# Altium schematic sheet ESRA_tsk3000 - Copy.SchDoc
size A2; PageSetup: Record=PageOptions|CenterHorizontal=True|CenterVertical=True|PrintScale=0.50|XCorrection=1.00|YCorrection=1.00|PrintKind=1|BorderSize=5000000|LeftOffset=0|BottomOffset=0|Orientation=2|PaperLength=1000|PaperWidth=1000|Scale=100|PaperSource=15|PrintQuality=600|MediaType=1|DitherType=10|PaperKind=A3 (297 x 420 mm)|PrintScaleMode=1
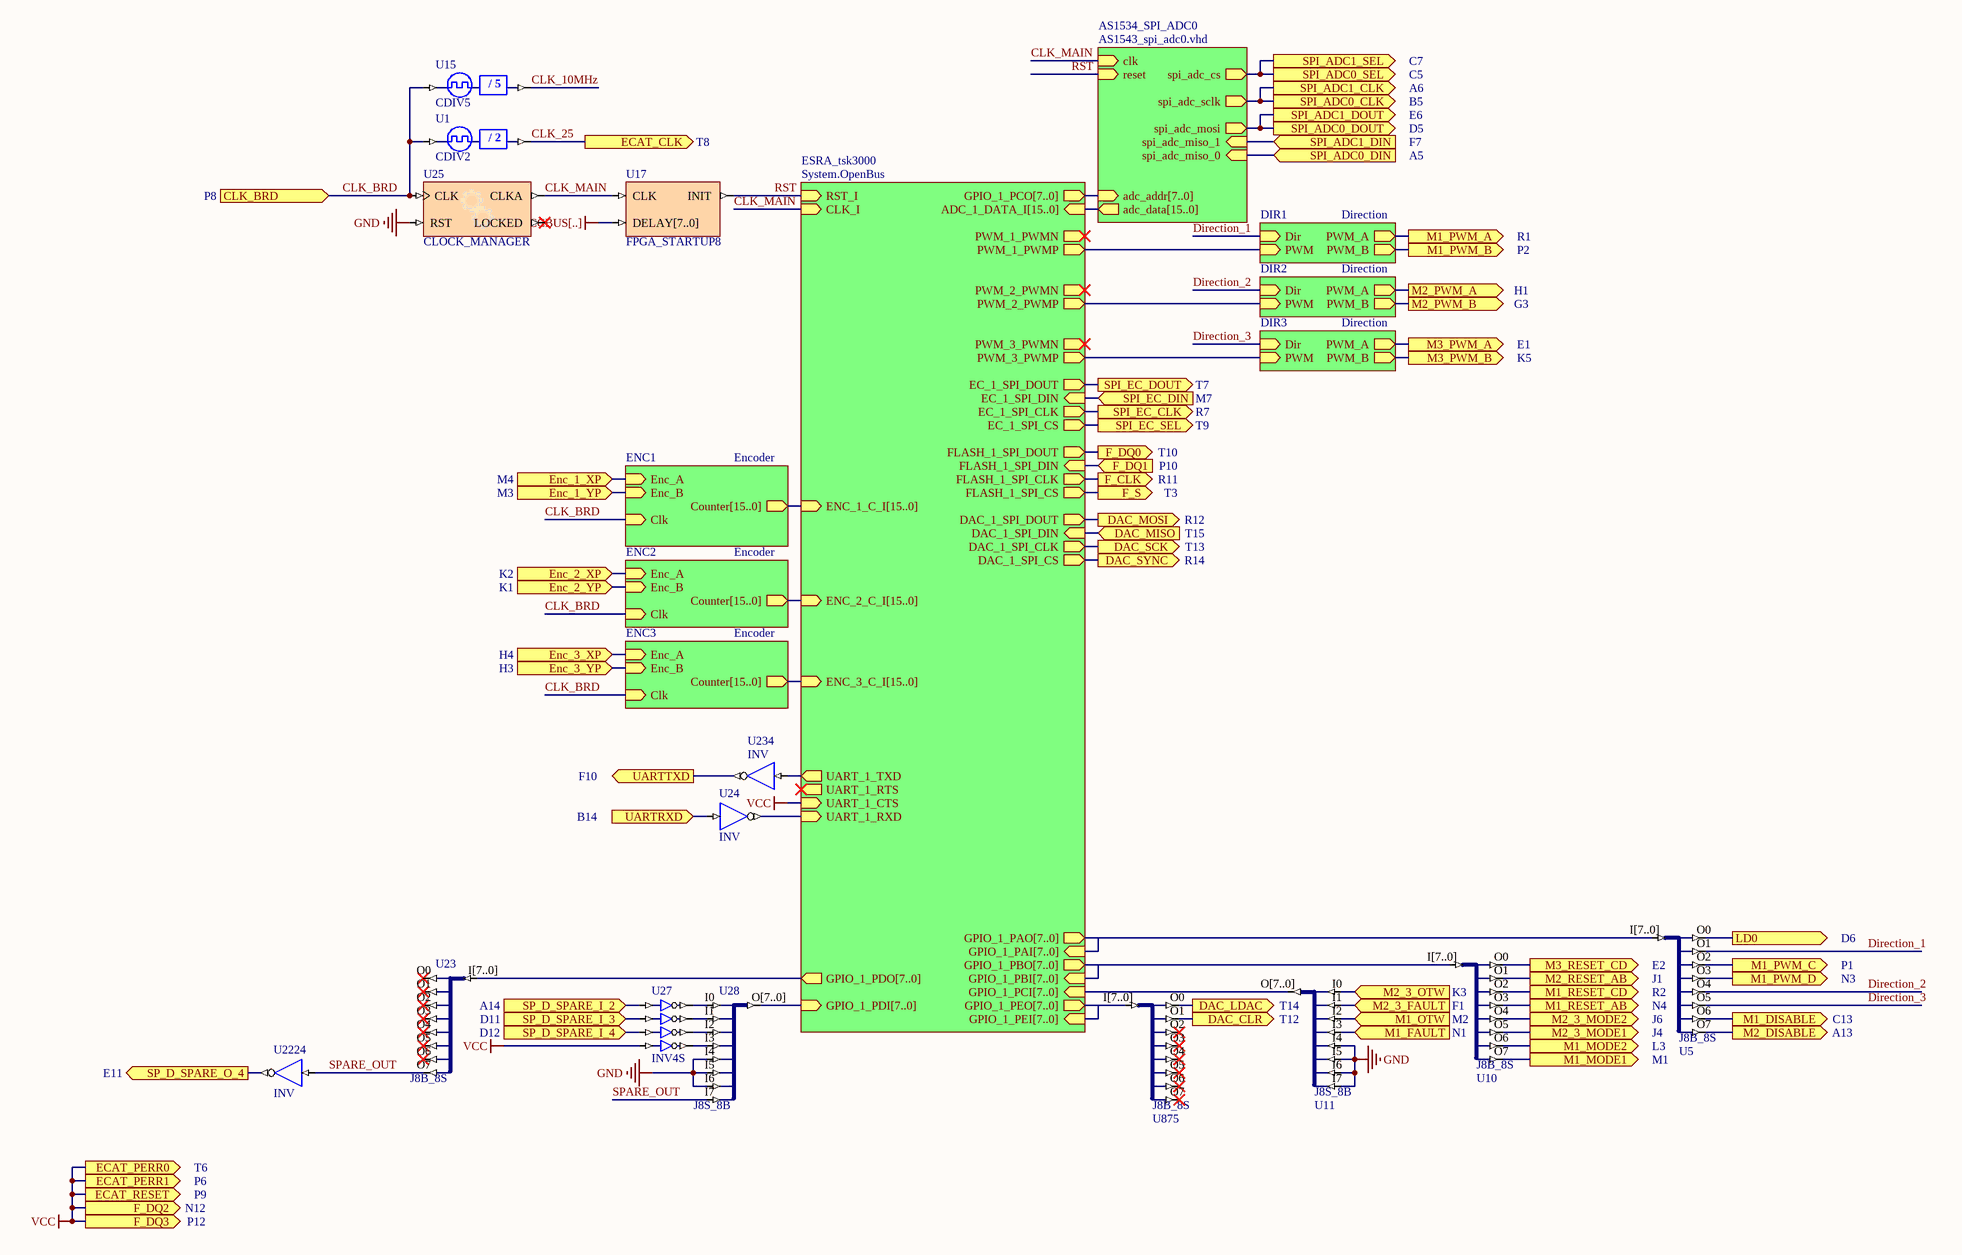
[diagram p0: ESRA_tsk3000 - Copy.SchDoc]

## Parts
U1  CDIV2
U5  J8B_8S
U10  J8B_8S
U11  J8S_8B
U15  CDIV5
U17  FPGA_STARTUP8
U23  J8B_8S
U24  INV
U25  CLOCK_MANAGER
U27  INV4S
U28  J8S_8B
U234  INV
U875  J8B_8S
U2224  INV

## Sub-sheets
AS1534_SPI_ADC0 = AS1543_spi_adc0.vhd: clk (in), spi_adc_sclk (out), spi_adc_mosi (out), spi_adc_cs (out), adc_addr[7..0] (in), adc_data[15..0] (out), reset (in), spi_adc_miso_0 (in), spi_adc_miso_1 (in)
DIR1 = Direction: Dir (in), PWM (in), PWM_A (out), PWM_B (out)
DIR2 = Direction: Dir (in), PWM (in), PWM_A (out), PWM_B (out)
DIR3 = Direction: Dir (in), PWM (in), PWM_A (out), PWM_B (out)
ENC1 = Encoder: Enc_A (in), Enc_B (in), Clk (in), Counter[15..0] (out)
ENC2 = Encoder: Enc_A (in), Enc_B (in), Clk (in), Counter[15..0] (out)
ENC3 = Encoder: Enc_A (in), Enc_B (in), Clk (in), Counter[15..0] (out)
ESRA_tsk3000 = System.OpenBus: RST_I (in), CLK_I (in), EC_1_SPI_DOUT (out), EC_1_SPI_DIN (in), EC_1_SPI_CLK (out), EC_1_SPI_CS (out), ENC_1_C_I[15..0] (in), ENC_2_C_I[15..0] (in), ENC_3_C_I[15..0] (in), PWM_1_PWMN (out), PWM_1_PWMP (out), PWM_2_PWMN (out), PWM_2_PWMP (out), PWM_3_PWMN (out), PWM_3_PWMP (out), GPIO_1_PAO[7..0] (out), GPIO_1_PBO[7..0] (out), GPIO_1_PAI[7..0] (in), GPIO_1_PBI[7..0] (in), ADC_1_DATA_I[15..0] (in), UART_1_TXD (out), UART_1_RXD (in), UART_1_CTS (in), UART_1_RTS (out), GPIO_1_PCO[7..0] (out), GPIO_1_PCI[7..0] (in), DAC_1_SPI_DOUT (out), DAC_1_SPI_DIN (in), DAC_1_SPI_CLK (out), DAC_1_SPI_CS (out), GPIO_1_PDO[7..0] (out), GPIO_1_PDI[7..0] (in), GPIO_1_PEO[7..0] (out), GPIO_1_PEI[7..0] (in), FLASH_1_SPI_DOUT (out), FLASH_1_SPI_DIN (in), FLASH_1_SPI_CLK (out), FLASH_1_SPI_CS (out)

## Ports
CLK_BRD (in, see P8), DAC_CLR (out, see T12), DAC_LDAC (out, see T14), DAC_MISO (in, see T15), DAC_MOSI (out, see R12), DAC_SCK (out, see T13), DAC_SYNC (out, see R14), ECAT_CLK (out, see T8), ECAT_PERR0 (out, see T6), ECAT_PERR1 (out, see P6), ECAT_RESET (out, see P9), Enc_1_XP (in, see M4), Enc_1_YP (in, see M3), Enc_2_XP (in, see K2), Enc_2_YP (in, see K1), Enc_3_XP (in, see H4), Enc_3_YP (in, see H3), F_CLK (out, see R11), F_DQ0 (out, see T10), F_DQ1 (in, see P10), F_DQ2 (out, see N12), F_DQ3 (out, see P12), F_S (out, see T3), LD0 (out, see D6), M1_DISABLE (out, see C13), M1_FAULT (in, see N1), M1_MODE1 (out, see M1), M1_MODE2 (out, see L3), M1_OTW (in, see M2), M1_PWM_A (out, see R1), M1_PWM_B (out, see P2), M1_PWM_C (out, see P1), M1_PWM_D (out, see N3), M1_RESET_AB (out, see N4), M1_RESET_CD (out, see R2), M2_3_FAULT (in, see F1), M2_3_MODE1 (out, see J4), M2_3_MODE2 (out, see J6), M2_3_OTW (in, see K3), M2_DISABLE (out, see A13), M2_PWM_A (out, see H1), M2_PWM_B (out, see G3), M2_RESET_AB (out, see J1), M3_PWM_A (out, see E1), M3_PWM_B (out, see K5), M3_RESET_CD (out, see E2), SP_D_SPARE_I_2 (in, see A14), SP_D_SPARE_I_3 (in, see D11), SP_D_SPARE_I_4 (in, see D12), SP_D_SPARE_O_4 (out, see E11), SPI_ADC0_CLK (out, see B5), SPI_ADC0_DIN (in, see A5), SPI_ADC0_DOUT (out, see D5), SPI_ADC0_SEL (out, see C5), SPI_ADC1_CLK (out, see A6), SPI_ADC1_DIN (in, see F7), SPI_ADC1_DOUT (out, see E6), SPI_ADC1_SEL (out, see C7), SPI_EC_CLK (out, see R7), SPI_EC_DIN (in, see M7), SPI_EC_DOUT (out, see T7), SPI_EC_SEL (out, see T9), UARTRXD (in, see B14), UARTTXD (out, see F10)

## Nets
GND: U11.I4 U11.I5 U11.I6 U11.I7 U25.RST U28.I4 U28.I5 U28.I6
VCC: U27.I3 ; port ECAT_PERR0, port ECAT_PERR1, port ECAT_RESET, port F_DQ2, port F_DQ3, sheet ESRA_tsk3000/UART_1_CTS
VCCBUS[..]: U17.DELAY[7..0]
CLK_10MHz: U15.CLKDV
CLK_25: U1.CLKDV ; port ECAT_CLK
CLK_BRD: U1.CLKIN U15.CLKIN U25.CLK ; port CLK_BRD, sheet ENC1/Clk, sheet ENC2/Clk, sheet ENC3/Clk
CLK_MAIN: U17.CLK U25.CLKA ; sheet ESRA_tsk3000/CLK_I, sheet AS1534_SPI_ADC0/clk
DAC_CLR: U875.O1 ; port DAC_CLR
DAC_LDAC: U875.O0 ; port DAC_LDAC
DAC_MISO: port DAC_MISO, sheet ESRA_tsk3000/DAC_1_SPI_DIN
DAC_MOSI: port DAC_MOSI, sheet ESRA_tsk3000/DAC_1_SPI_DOUT
DAC_SCK: port DAC_SCK, sheet ESRA_tsk3000/DAC_1_SPI_CLK
DAC_SYNC: port DAC_SYNC, sheet ESRA_tsk3000/DAC_1_SPI_CS
Direction_1: U5.O1 ; sheet DIR1/Dir
Direction_2: U5.O4 ; sheet DIR2/Dir
Direction_3: U5.O5 ; sheet DIR3/Dir
Enc_1_XP: port Enc_1_XP, sheet ENC1/Enc_A
Enc_1_YP: port Enc_1_YP, sheet ENC1/Enc_B
Enc_2_XP: port Enc_2_XP, sheet ENC2/Enc_A
Enc_2_YP: port Enc_2_YP, sheet ENC2/Enc_B
Enc_3_XP: port Enc_3_XP, sheet ENC3/Enc_A
Enc_3_YP: port Enc_3_YP, sheet ENC3/Enc_B
F_CLK: port F_CLK, sheet ESRA_tsk3000/FLASH_1_SPI_CLK
F_DQ0: port F_DQ0, sheet ESRA_tsk3000/FLASH_1_SPI_DOUT
F_DQ1: port F_DQ1, sheet ESRA_tsk3000/FLASH_1_SPI_DIN
F_S: port F_S, sheet ESRA_tsk3000/FLASH_1_SPI_CS
LD0: U5.O0 ; port LD0
M1_DISABLE: U5.O6 ; port M1_DISABLE
M1_FAULT: U11.I3 ; port M1_FAULT
M1_MODE1: U10.O7 ; port M1_MODE1
M1_MODE2: U10.O6 ; port M1_MODE2
M1_OTW: U11.I2 ; port M1_OTW
M1_PWM_A: port M1_PWM_A, sheet DIR1/PWM_A
M1_PWM_B: port M1_PWM_B, sheet DIR1/PWM_B
M1_PWM_C: U5.O2 ; port M1_PWM_C
M1_PWM_D: U5.O3 ; port M1_PWM_D
M1_RESET_AB: U10.O3 ; port M1_RESET_AB
M1_RESET_CD: U10.O2 ; port M1_RESET_CD
M2_3_FAULT: U11.I1 ; port M2_3_FAULT
M2_3_MODE1: U10.O5 ; port M2_3_MODE1
M2_3_MODE2: U10.O4 ; port M2_3_MODE2
M2_3_OTW: U11.I0 ; port M2_3_OTW
M2_DISABLE: U5.O7 ; port M2_DISABLE
M2_PWM_A: port M2_PWM_A, sheet DIR2/PWM_A
M2_PWM_B: port M2_PWM_B, sheet DIR2/PWM_B
M2_RESET_AB: U10.O1 ; port M2_RESET_AB
M3_PWM_A: port M3_PWM_A, sheet DIR3/PWM_A
M3_PWM_B: port M3_PWM_B, sheet DIR3/PWM_B
M3_RESET_CD: U10.O0 ; port M3_RESET_CD
RST: U17.INIT ; sheet ESRA_tsk3000/RST_I, sheet AS1534_SPI_ADC0/reset
SP_D_SPARE_I_2: U27.I0 ; port SP_D_SPARE_I_2
SP_D_SPARE_I_3: U27.I1 ; port SP_D_SPARE_I_3
SP_D_SPARE_I_4: U27.I2 ; port SP_D_SPARE_I_4
SP_D_SPARE_O_4: U2224.O ; port SP_D_SPARE_O_4
SPARE_OUT: U23.O7 U28.I7 U2224.I
SPI_ADC0_CLK: port SPI_ADC0_CLK, port SPI_ADC1_CLK, sheet AS1534_SPI_ADC0/spi_adc_sclk
SPI_ADC0_DIN: port SPI_ADC0_DIN, sheet AS1534_SPI_ADC0/spi_adc_miso_0
SPI_ADC0_DOUT: port SPI_ADC0_DOUT, port SPI_ADC1_DOUT, sheet AS1534_SPI_ADC0/spi_adc_mosi
SPI_ADC0_SEL: port SPI_ADC0_SEL, port SPI_ADC1_SEL, sheet AS1534_SPI_ADC0/spi_adc_cs
SPI_ADC1_DIN: port SPI_ADC1_DIN, sheet AS1534_SPI_ADC0/spi_adc_miso_1
SPI_EC_CLK: port SPI_EC_CLK, sheet ESRA_tsk3000/EC_1_SPI_CLK
SPI_EC_DIN: port SPI_EC_DIN, sheet ESRA_tsk3000/EC_1_SPI_DIN
SPI_EC_DOUT: port SPI_EC_DOUT, sheet ESRA_tsk3000/EC_1_SPI_DOUT
SPI_EC_SEL: port SPI_EC_SEL, sheet ESRA_tsk3000/EC_1_SPI_CS
UARTRXD: U24.I ; port UARTRXD
UARTTXD: U234.O ; port UARTTXD
NetU5_I[7..0]: U5.I[7..0] ; sheet ESRA_tsk3000/GPIO_1_PAO[7..0], sheet ESRA_tsk3000/GPIO_1_PAI[7..0]
NetU10_I[7..0]: U10.I[7..0] ; sheet ESRA_tsk3000/GPIO_1_PBO[7..0], sheet ESRA_tsk3000/GPIO_1_PBI[7..0]
NetU11_O[7..0]: U11.O[7..0] ; sheet ESRA_tsk3000/GPIO_1_PCI[7..0]
NetU23_I[7..0]: U23.I[7..0] ; sheet ESRA_tsk3000/GPIO_1_PDO[7..0]
NetU24_O: U24.O ; sheet ESRA_tsk3000/UART_1_RXD
NetU27_O0: U27.O0 U28.I0
NetU27_O1: U27.O1 U28.I1
NetU27_O2: U27.O2 U28.I2
NetU27_O3: U27.O3 U28.I3
NetU28_O[7..0]: U28.O[7..0] ; sheet ESRA_tsk3000/GPIO_1_PDI[7..0]
NetU234_I: U234.I ; sheet ESRA_tsk3000/UART_1_TXD
NetU875_I[7..0]: U875.I[7..0] ; sheet ESRA_tsk3000/GPIO_1_PEO[7..0], sheet ESRA_tsk3000/GPIO_1_PEI[7..0]
(unnamed): sheet ESRA_tsk3000/PWM_1_PWMP, sheet DIR1/PWM
(unnamed): sheet ESRA_tsk3000/PWM_2_PWMP, sheet DIR2/PWM
(unnamed): sheet ESRA_tsk3000/PWM_3_PWMP, sheet DIR3/PWM

Not connected (* = marked no-connect by the designer): U23 O0* O1* O2* O3* O4* O5* O6*; U25 LOCKED*; U875 O2* O3* O4* O5* O6* O7*

## Buses and harness runs
bus sheet AS1534_SPI_ADC0/adc_addr[7..0] = sheet ESRA_tsk3000/GPIO_1_PCO[7..0]
bus sheet AS1534_SPI_ADC0/adc_data[15..0] = sheet ESRA_tsk3000/ADC_1_DATA_I[15..0]
bus sheet ENC1/Counter[15..0] = sheet ESRA_tsk3000/ENC_1_C_I[15..0]
bus sheet ENC2/Counter[15..0] = sheet ESRA_tsk3000/ENC_2_C_I[15..0]
bus sheet ENC3/Counter[15..0] = sheet ESRA_tsk3000/ENC_3_C_I[15..0]
bus sheet ESRA_tsk3000/GPIO_1_PAI[7..0] = sheet ESRA_tsk3000/GPIO_1_PAO[7..0]
bus sheet ESRA_tsk3000/GPIO_1_PBI[7..0] = sheet ESRA_tsk3000/GPIO_1_PBO[7..0]
bus sheet ESRA_tsk3000/GPIO_1_PEI[7..0] = sheet ESRA_tsk3000/GPIO_1_PEO[7..0]

## Notes on the sheet
- (in symbol CDIV2) / 2
- (in symbol CDIV5) / 5

## Library data of the parts
U1 = CDIV2: Clock Divider by 2; DivisorRate: 2; ArchiveName: GENERIC; VHDLIB_SIM: GENERIC_LIB; Published: 29-Jan-2004; Publisher: Altium Limited; LastRevisionNo: 1.00.00; HelpURL: CR0118 FPGA Generic Library Guide.pdf#page=142; ComponentLink1URL: CR0127 FPGA Clock Divider Resource Usage.pdf#page=2; ComponentLink1Description: Core &Resource Usage; FunctionalClass: Clock Divider
U5 U10 U23 U875 = J8B_8S: 8-Bit input bus to 8 single pin outputs; FunctionalClass: Bus Joiner; PortSize: 8; ArchiveName: GENERIC; VHDLIB_SIM: GENERIC_LIB; Published: 29-Jan-2004; Publisher: Altium Limited; LastRevisionNo: 1.00.00; HelpURL: CR0118 FPGA Generic Library Guide.pdf#page=304; ComponentLink1URL: CR0126 FPGA Bus Joiner Resource Usage.pdf#page=27; ComponentLink1Description: Core &Resource Usage
U11 U28 = J8S_8B: 8 Single pin inputs to single 8-Bit output bus; FunctionalClass: Bus Joiner; PortSize: 8; ArchiveName: GENERIC; VHDLIB_SIM: GENERIC_LIB; Published: 29-Jan-2004; Publisher: Altium Limited; LastRevisionNo: 1.00.00; HelpURL: CR0118 FPGA Generic Library Guide.pdf#page=306; ComponentLink1URL: CR0126 FPGA Bus Joiner Resource Usage.pdf#page=28; ComponentLink1Description: Core &Resource Usage
U15 = CDIV5: Clock Divider by 5; DivisorRate: 5; ArchiveName: GENERIC; VHDLIB_SIM: GENERIC_LIB; Published: 29-Jan-2004; Publisher: Altium Limited; LastRevisionNo: 1.00.00; HelpURL: CR0118 FPGA Generic Library Guide.pdf#page=142; ComponentLink1URL: CR0127 FPGA Clock Divider Resource Usage.pdf#page=7; ComponentLink1Description: Core &Resource Usage; FunctionalClass: Clock Divider
U17 = FPGA_STARTUP8: FPGA Startup With 8 Bit Delay; Published: 9-Dec-2004; Publisher: Altium Limited; HelpURL: CR0119 FPGA_STARTUPx Powerup Delay Unit.pdf; LastRevisionNo: 1.00.00; ComponentLink1Description: Core &Resource Usage; ComponentLink1URL: CR0139 FPGA Peripheral Resource Usage.pdf#page=11
U24 U234 U2224 = INV: Inverter; FunctionalClass: Logic Primitive; ArchiveName: GENERIC; VHDLIB_SIM: GENERIC_LIB; Published: 29-Jan-2004; Publisher: Altium Limited; XilinxEquivalent: INV; LastRevisionNo: 1.00.00; HelpURL: CR0118 FPGA Generic Library Guide.pdf#page=291; ComponentLink1URL: CR0136 FPGA Logic Primitive Resource Usage.pdf#page=61; ComponentLink1Description: Core &Resource Usage; SubClass: INV
U25 = CLOCKMANAGER: Configurable Clock Manager; ConfiguratorName: GENERIC_CLOCKMANAGER; ConfigurationParameters: {}Version[1.0]{}Option_Configuration[object _1: TClockManagerPersist / VersionMajor [ 0 / VersionMinor [ 0 / InputFreq [ 50.000000000000000000 / InputName [ 'CLK' / OutputTargets [ < / item / Name [ 'CLKA' / OutFreqMin [ 90.000000000000000000 / OutFreqMax [ 90.000000000000000000 / OutPostDivider [ 1.000000000000000000 / end> / OutputDevices [ < / item / Name [ 'Spartan6' / Valid [ True / OutputActuals [ < / item / Name [ 'CLK0' / Multipler [ 1.000000000000000000 / Divider [ 1.000000000000000000 / OutFreq [ 50.000000000000000000 / OutputMap [ 1 / end / item / Name [ 'CLK90' / Multipler [ 1.000000000000000000 / Divider [ 1.000000000000000000 / OutPhase [ 90.000000000000000000 / OutFreq [ 50.000000000000000000 / OutputMap [ 2 / end / item / Name [ 'CLK180' / Multipler [ 1.000000000000000000 / Divider [ 1.000000000000000000 / OutPhase [ 180.000000000000000000 / OutFreq [ 50.000000000000000000 / OutputMap [ 3 / end / item / Name [ 'CLK270' / Multipler [ 1.000000000000000000 / Divider [ 1.000000000000000000 / OutPhase [ 270.000000000000000000 / OutFreq [ 50.000000000000000000 / OutputMap [ 4 / end / item / Name [ 'CLK2X' / Multipler [ 2.000000000000000000 / Divider [ 1.000000000000000000 / OutFreq [ 100.000000000000000000 / OutputMap [ 5 / end / item / Name [ 'CLKDV' / Multipler [ 1.000000000000000000 / Divider [ 16.000000000000000000 / OutFreq [ 3.125000000000000000 / OutputMap [ 6 / end / item / Name [ 'CLK2X180' / Multipler [ 1.000000000000000000 / Divider [ 1.000000000000000000 / OutPhase [ 180.000000000000000000 / OutFreq [ 100.000000000000000000 / OutputMap [ 7 / end / item / Name [ 'CLKFX' / Multipler [ 9.000000000000000000 / Divider [ 5.000000000000000000 / OutFreq [ 90.000000000000000000 / OutputMap [ 0 / end / item / Name [ 'CLKFX180' / Multipler [ 1.000000000000000000 / Divider [ 1.000000000000000000 / OutPhase [ 180.000000000000000000 / OutFreq [ 90.000000000000000000 / OutputMap [ 8 / end> / InternalActuals [ <> / CustomVars [ <> / end> / MinInputFreq [ 5.000000000000000000 / MaxInputFreq [ 280.000000000000000000 / MinOutputFreq [ 5.000000000000000000 / MaxOutputFreq [ 375.000000000000000000 / MaxOutputCount [ 9 / end]{}; LastRevisionNo: 1.00.00; Published: 18-Feb-2009; Publisher: Altium Limited; HelpURL: https://wiki.altium.com/display/ADOH/New+Configurable+Generic+FPGA+Logic+Components
U27 = INV4S: 4-Bit Inverter, Single Pin Version; XilinxEquivalent: INV4; FunctionalClass: Logic Primitive; SubClass: INV; PortSize: 4; ArchiveName: GENERIC; VHDLIB_SIM: GENERIC_LIB; Published: 29-Jan-2004; Publisher: Altium Limited; LastRevisionNo: 1.00.00; HelpURL: CR0118 FPGA Generic Library Guide.pdf#page=291; ComponentLink1URL: CR0136 FPGA Logic Primitive Resource Usage.pdf#page=67; ComponentLink1Description: Core &Resource Usage; PortStyle: Single Pin Version